# EasyEDA Pro project uven2-mk3-cc-driver-25x.eprj, schematic Schematic1
Board Name: Board1; Create Date: 2025-07-06; Page Name: P1; Project Name: uven2-mk3-cc-driver-25x; Schematic Name: Schematic1; Update Date: 2025-08-19; Company: EasyEDA.com; Page Size: A4; Version: V1.0
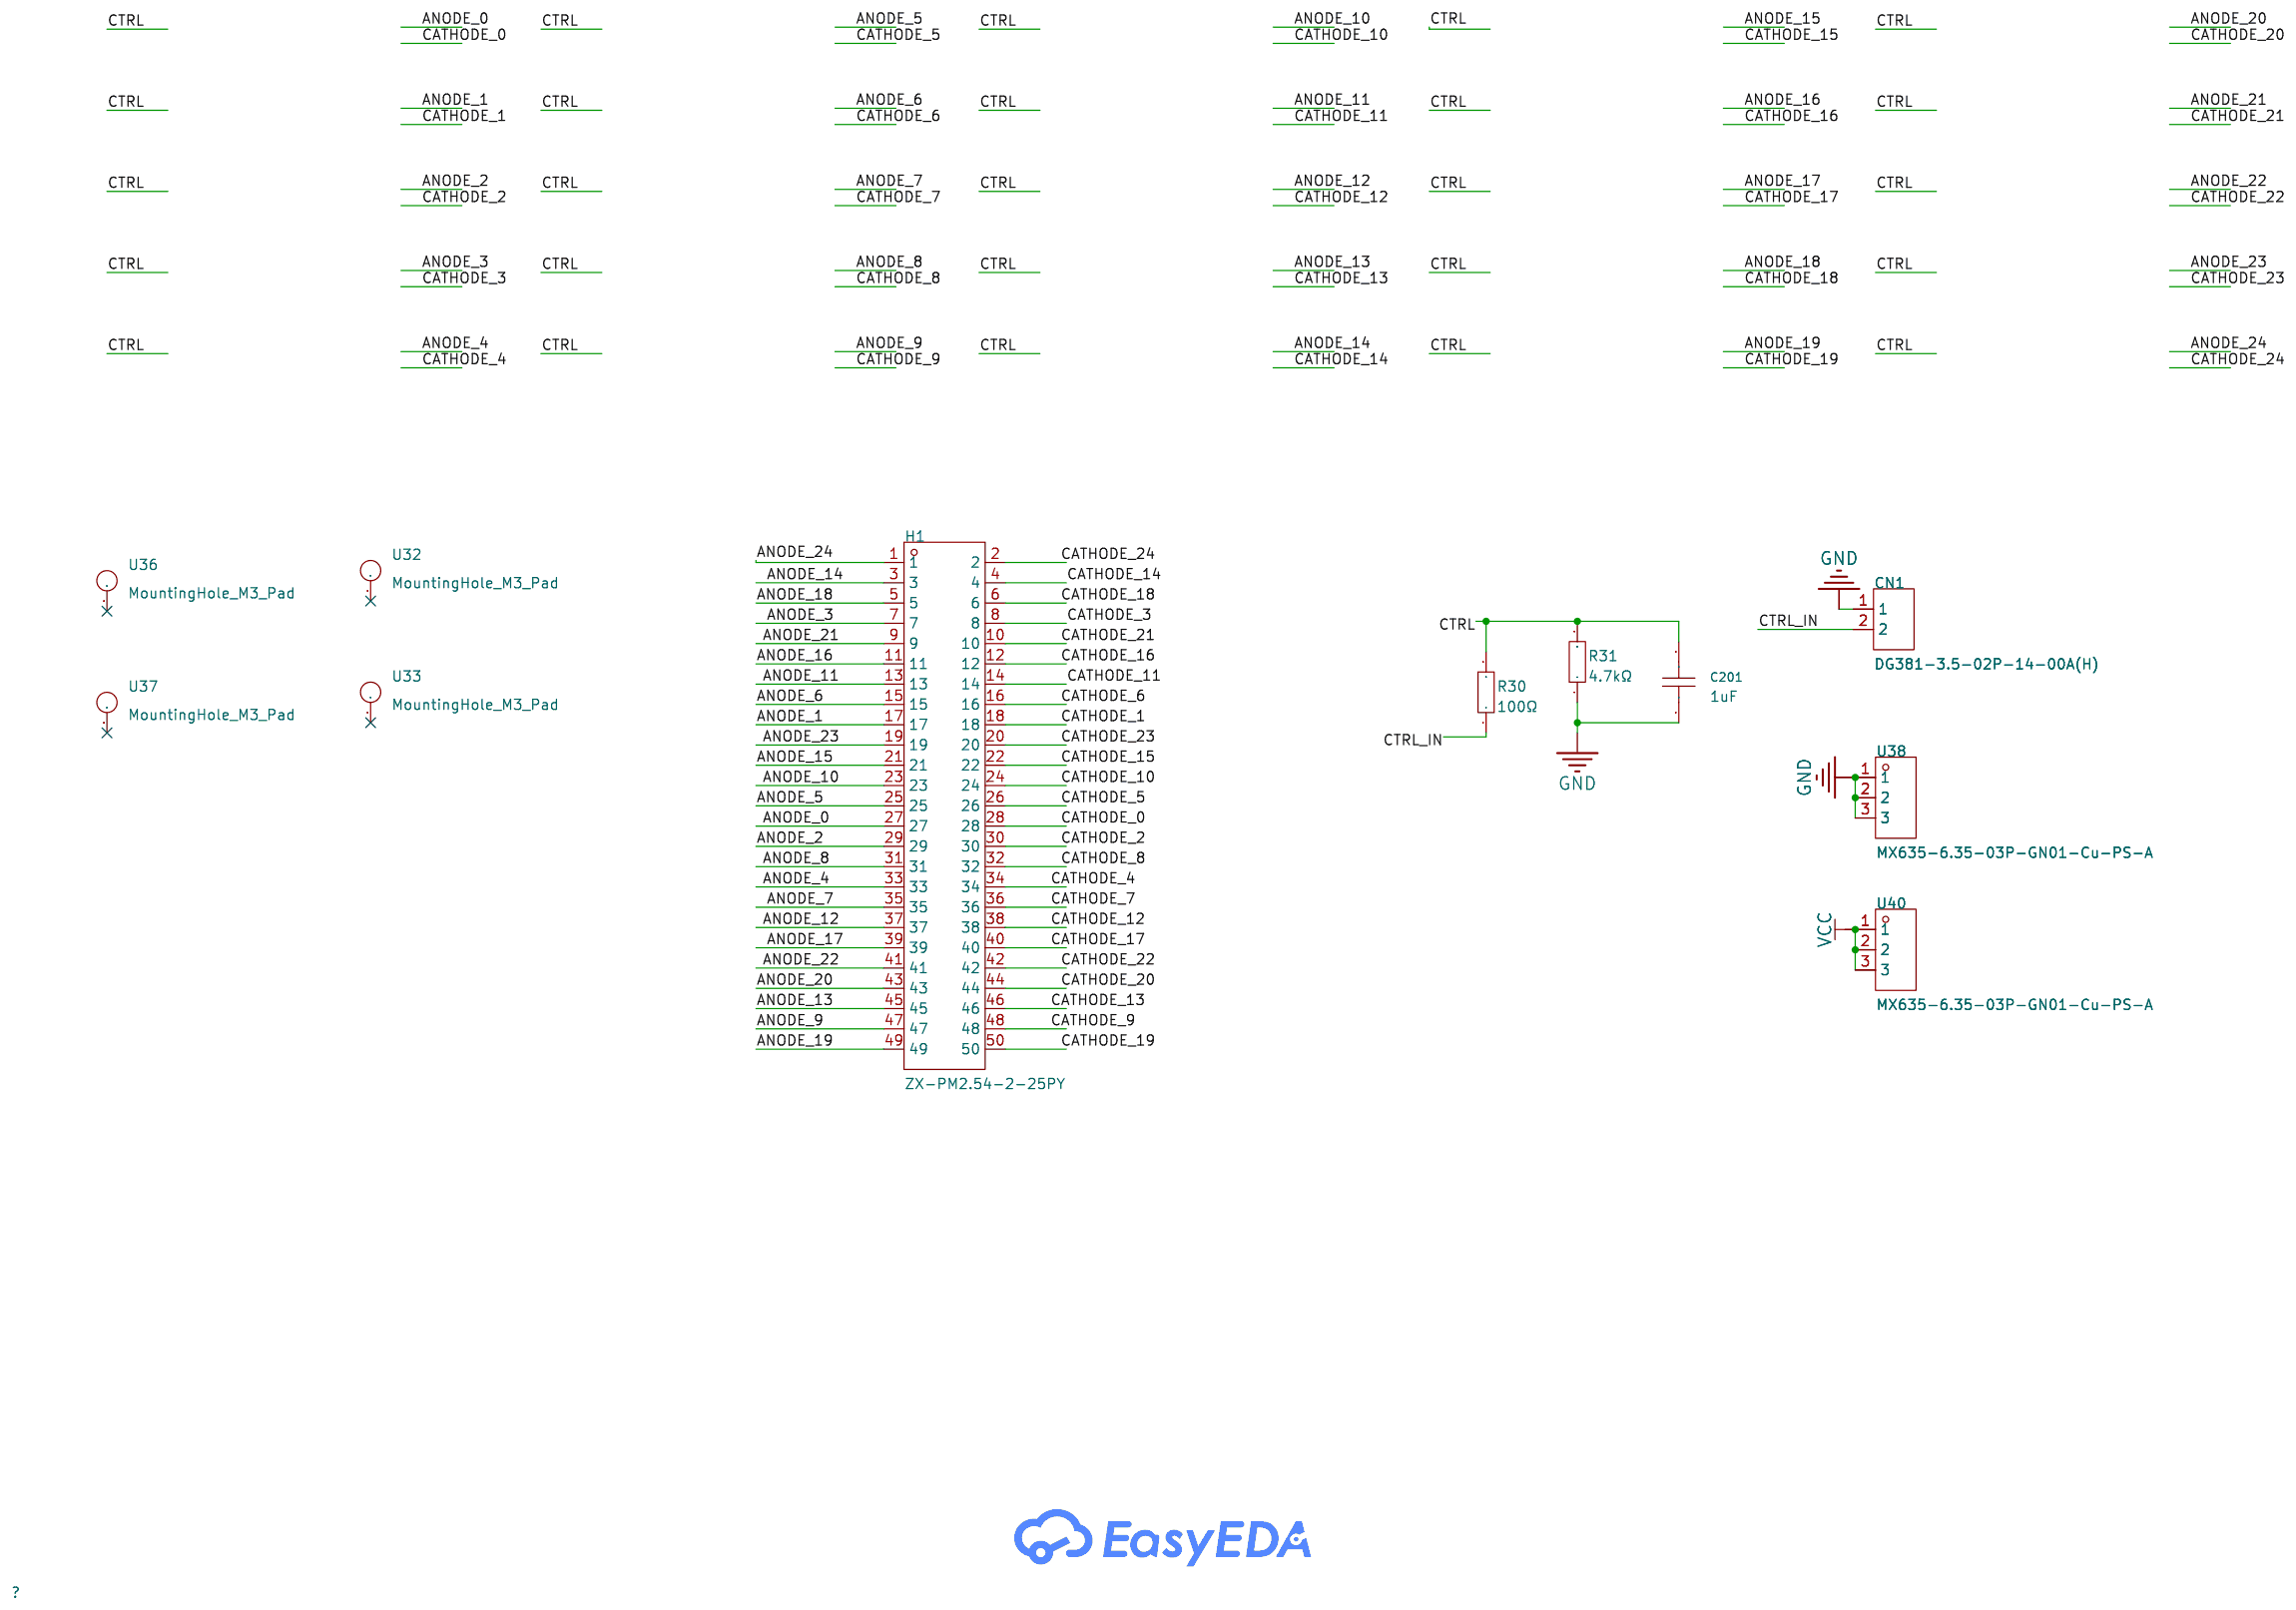
[diagram p0: schematic sheet]

## Parts
C201  1uF  [C0805]
CBB0  -
CBB1  -
CBB2  -
CBB3  -
CBB4  -
CBB5  -
CBB6  -
CBB7  -
CBB8  -
CBB9  -
CBB10  -
CBB11  -
CBB12  -
CBB13  -
CBB14  -
CBB15  -
CBB16  -
CBB17  -
CBB18  -
CBB19  -
CBB20  -
CBB21  -
CBB22  -
CBB23  -
CBB24  -
CN1  DG381-3.5-02P-14-00A(H)  [CONN-TH_2P-P3.50_DG381-3.5-02P-14-00A]
H1  ZX-PM2.54-2-25PY  [HDR-TH_50P-P2.54-V-F-R2-C25-S2.54-1]
R30  100Ω  [R0603]
R31  4.7kΩ  [R0603]
U32  MountingHole_M3_Pad  [MountingHole_3.2mm_M3_DIN965_Pad_TopOnly]
U33  MountingHole_M3_Pad  [MountingHole_3.2mm_M3_DIN965_Pad_TopOnly]
U36  MountingHole_M3_Pad  [MountingHole_3.2mm_M3_DIN965_Pad_TopOnly]
U37  MountingHole_M3_Pad  [MountingHole_3.2mm_M3_DIN965_Pad_TopOnly]
U38  MX635-6.35-03P-GN01-Cu-PS-A  [CONN-TH_MX635-6.35-03P-GN01-CU-PS-A]
U40  MX635-6.35-03P-GN01-Cu-PS-A  [CONN-TH_MX635-6.35-03P-GN01-CU-PS-A]

## Library data of the parts
C201 = CC0805KKX5R6BB105: LCSC Part Name: 1uF ±10% 10V; Supplier Part: C408907; Manufacturer: YAGEO(国巨); Supplier Footprint: 0805; JLCPCB Part Class: Extended Part; Datasheet: https://item.szlcsc.com/datasheet/CC0805KKX5R6BB105/398438.html; Supplier: LCSC; Tolerance: ±10%; Voltage Rating: 10V; Temperature Coefficient: X5R
CN1 = DG381-3.5-02P-14-00A(H): LCSC Part Name: 3.5mm 直插 排数:1 每排P数:2; Supplier Part: C5272864; Manufacturer: DEGSON(高正/高松); Supplier Footprint: 插件,P=3.5mm; JLCPCB Part Class: Extended Part; Datasheet: https://atta.szlcsc.com/upload/public/pdf/source/20221116/069171FF23C61B982410A9A369C7D043.pdf; Supplier: LCSC; Pitch: 3.5mm; Mounting Type: Direct Insert; Number of Pins: 2P; Number of Rows: 1; Number of PINs Per Row: 2
H1 = ZX-PM2.54-2-25PY: LCSC Part Name: 2x25P 间距:2.54mm 直插; Supplier Part: C7499355; Manufacturer: Megastar(兆星); Supplier Footprint: 插件,P=2.54mm; JLCPCB Part Class: Extended Part; Datasheet: https://atta.szlcsc.com/upload/public/pdf/source/20231122/49E5BFC403566950E1C41AC60FCE7E93.pdf; Supplier: LCSC; Holes Structure: 2x25P; Pitch: 2.54mm; Row Spacing: 2.54mm; Circular Hole / Square Hole: Square Hole; Mounting Type: Direct Insert; Number of Rows: Double Row; Number of Holes: 50P; Voltage Rating (Max): 1kV; Holes Direction: Top; Insulation Height: 8.5mm; Contact Plating: Gold; Operating Temperature Range: -40℃~+105℃; Soldering Temperature(Max): 260℃@5S
R30 = 0603WAF1000T5E: LCSC Part Name: 100Ω ±1% 100mW 厚膜电阻; Supplier Part: C22775; Manufacturer: UNI-ROYAL(厚声); Supplier Footprint: 0603; JLCPCB Part Class: Basic Part; Datasheet: https://atta.szlcsc.com/upload/public/pdf/source/20200306/C422600_1E6D84923E4A46A82E41ADD87F860B5C.pdf; Supplier: LCSC; Type: Thick Film Resistors; Tolerance: ±1%; Temperature Coefficient: ±200ppm/℃; Operating Temperature Range: -55℃~+155℃
R31 = 0603WAF4701T5E: LCSC Part Name: 4.7kΩ ±1% 100mW 厚膜电阻; Supplier Part: C23162; Manufacturer: UNI-ROYAL(厚声); Supplier Footprint: 0603; JLCPCB Part Class: Basic Part; Datasheet: https://item.szlcsc.com/datasheet/0603WAF4701T5E/23889.html; Supplier: LCSC; Type: Thick Film Resistor; Tolerance: ±1%; Power(Watts): 100mW; Voltage-Supply(Max): 75V; Temperature Coefficient: ±100ppm/℃; Operating Temperature: -55℃~+155℃
U32 U33 U36 U37 = Mounting_M3_Hole_Pad
U38 U40 = MX635-6.35-03P-GN01-Cu-PS-A: LCSC Part Name: 1x3P 6.35mm 直插 排数:1 每排P数:3; Supplier Part: C5188490; Manufacturer: MAX(迈旭); Supplier Footprint: 插件,P=6.35mm; JLCPCB Part Class: Extended Part; Datasheet: https://atta.szlcsc.com/upload/public/pdf/source/20230914/E96EF0C4F5613B81240CD428244EC64E.pdf; Supplier: LCSC; Structure: 1x3P; Pitch: 6.35mm; Color: Green; Mounting Style: Direct Insert; Number of Pins: 3P; Number of Rows: 1; Number of PINs Per Row: 3; Screw Specification: M3; Current Rating (Max): 30A; Voltage Rating (Max): 300V; Wire Gauge - AWG: 10~26; Wire Gauge - mm2: 4; Operating Temperature Range: -40℃~+105℃

## Nets
GND: C201.1 CN1.1 R31.1 U38.1 U38.2 U38.3
VCC: U40.1 U40.2 U40.3
ANODE_0: C201.2 CBB0.(ANODE) CBB1.(ANODE) CBB2.(ANODE) CBB3.(ANODE) CBB4.(ANODE) CBB5.(ANODE) CBB6.(ANODE) CBB7.(ANODE) CBB8.(ANODE) CBB9.(ANODE) CBB10.(ANODE) CBB11.(ANODE) CBB12.(ANODE) CBB13.(ANODE) CBB14.(ANODE) CBB15.(ANODE) CBB16.(ANODE) CBB17.(ANODE) CBB18.(ANODE) CBB19.(ANODE) CBB20.(ANODE) CBB21.(ANODE) CBB22.(ANODE) CBB23.(ANODE) CBB24.(ANODE) H1.1 H1.2 H1.3 H1.4 H1.5 H1.6 H1.7 H1.8 H1.9 H1.10 H1.11 H1.12 H1.13 H1.14 H1.15 H1.16 H1.17 H1.18 H1.19 H1.20 H1.21 H1.22 H1.23 H1.24 H1.25 H1.26 H1.27 H1.28 H1.29 H1.30 H1.31 H1.32 H1.33 H1.34 H1.35 H1.36 H1.37 H1.38 H1.39 H1.40 H1.41 H1.42 H1.43 H1.44 H1.45 H1.46 H1.47 H1.48 H1.49 H1.50 R30.2 R31.2
CTRL_IN: CN1.2 R30.1

Not connected (* = marked no-connect by the designer): U32 1*; U33 1*; U36 1*; U37 1*
